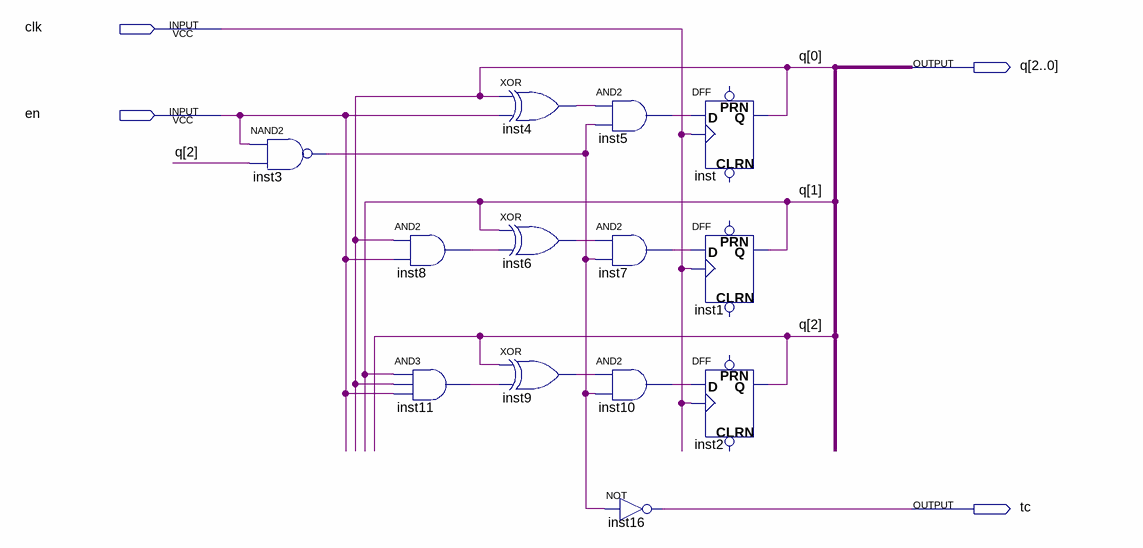
[diagram p0: schematic sheet]
// Quartus schematic ctr3div5.bdf as structural Verilog: 13 symbols, 4 pins
module ctr3div5 (
  input  clk,
  input  en,
  output [2:0] q,
  output tc
);

  wire inst3_out, inst4_out, inst5_out, inst6_out, inst7_out, inst8_out, inst9_out, inst10_out, inst11_out;

  nand inst3 (inst3_out, en, q[2]);
  and inst8 (inst8_out, q[0], en);
  and inst11 (inst11_out, q[1], q[0], en);
  xor inst4 (inst4_out, q[0], en);
  xor inst6 (inst6_out, q[1], inst8_out);
  xor inst9 (inst9_out, q[2], inst11_out);
  and inst5 (inst5_out, inst4_out, inst3_out);
  and inst7 (inst7_out, inst6_out, inst3_out);
  and inst10 (inst10_out, inst9_out, inst3_out);
  not inst16 (tc, inst3_out);
  DFF inst (.CLK(clk), .D(inst5_out), .Q(q[0]));  // open: CLRN, PRN
  DFF inst1 (.CLK(clk), .D(inst7_out), .Q(q[1]));  // open: CLRN, PRN
  DFF inst2 (.CLK(clk), .D(inst10_out), .Q(q[2]));  // open: CLRN, PRN
endmodule
